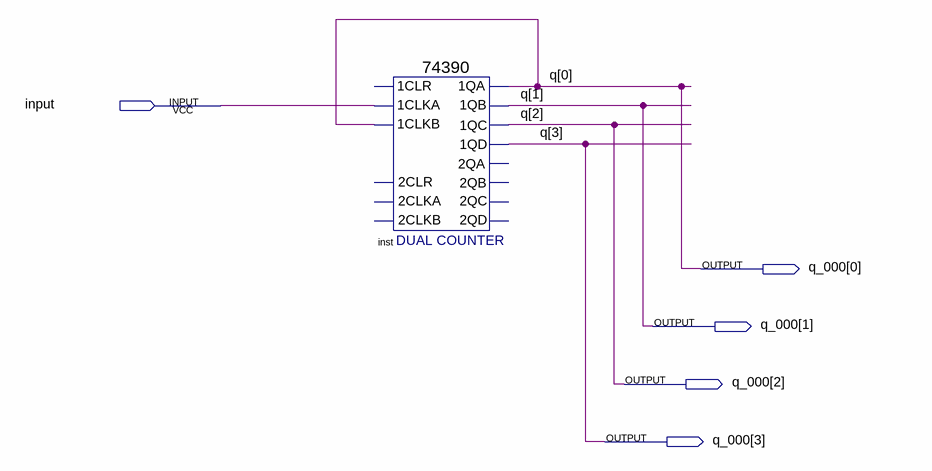
[diagram p0: schematic sheet]
// Quartus schematic m10.bdf as structural Verilog: 1 symbols, 5 pins
module m10 (
  input  \input ,
  output [3:0] q_000
);

  \74390  inst (
    .\1CLKA (\input ), .\1CLKB (q_000[0]), .\1QA (q_000[0]), .\1QB (q_000[1]), .\1QC (q_000[2]),
    .\1QD (q_000[3]));  // open: 2CLKA, 2CLR, 2CLKB, 1CLR, 2QA, 2QB, 2QC, 2QD

  // Other names for the same wires on the sheet: q[3:0] = q_000
endmodule
